# Altium schematic sheet Mainboard.SchDoc
size A4
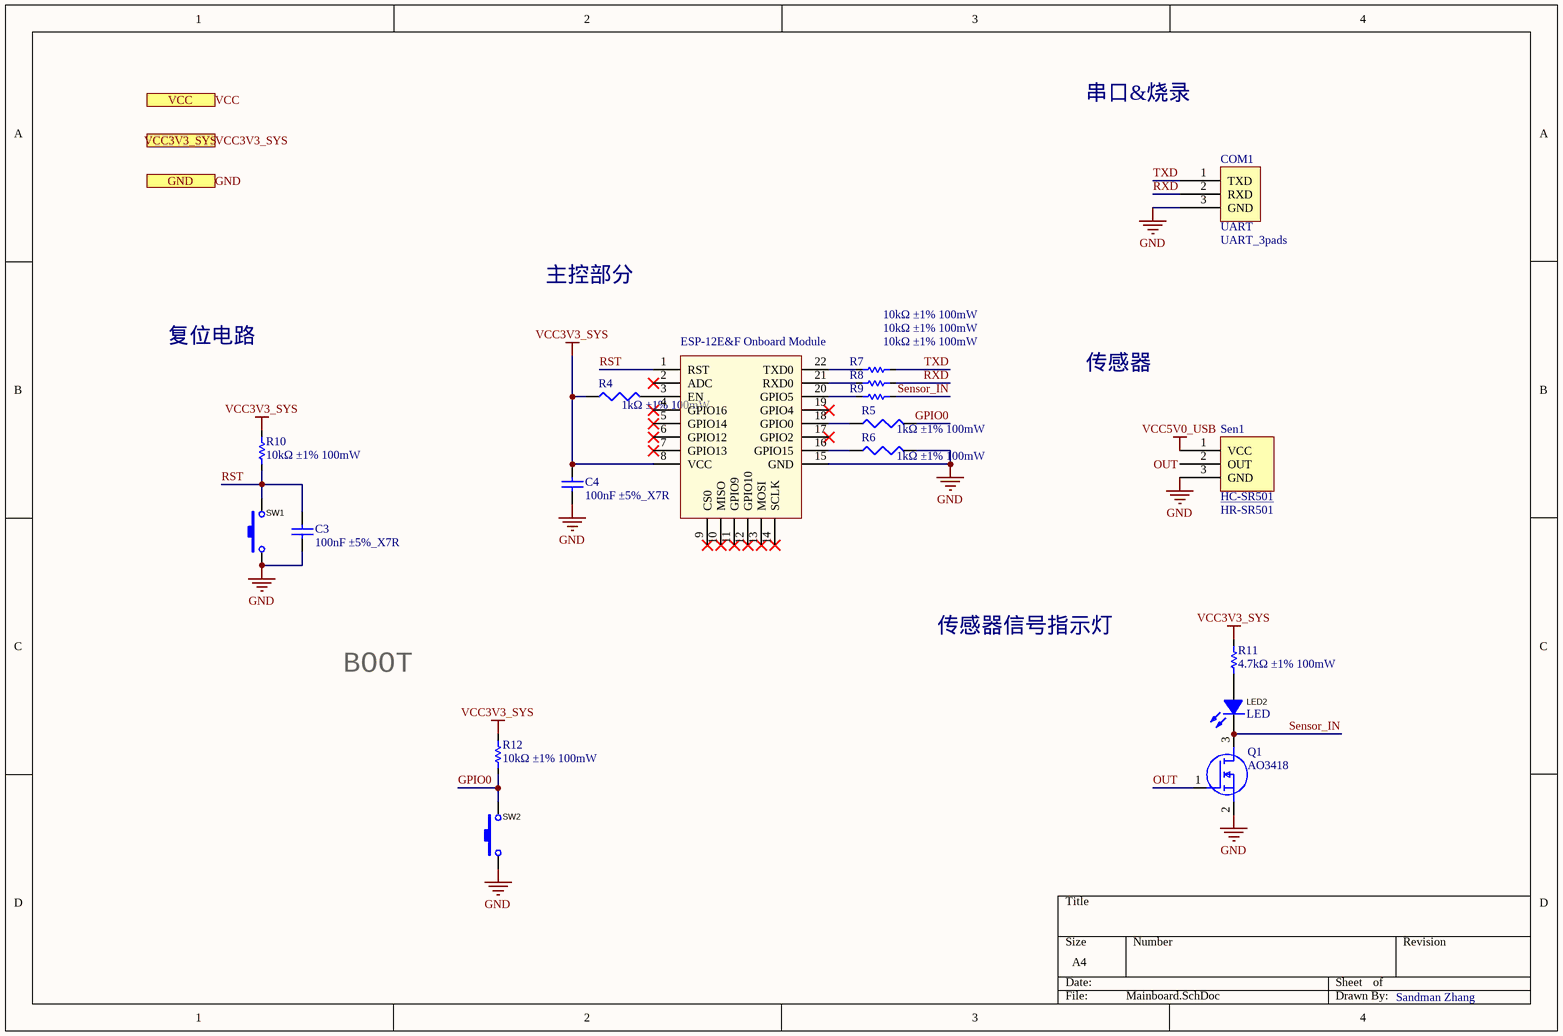
[diagram p0: Mainboard.SchDoc]

## Parts
C3  100nF ±5%_X7R  [C0603]
C4  100nF ±5%_X7R  [C0603]
COM1  UART_3pads  [3pads]
LED2  LED  [LED0603-RD]
Q1  AO3418  [SOT95P280X125-3N]
R4  value 1kΩ ±1% 100mW  [r0402]  (hidden comment: Res3)
R5  value 1kΩ ±1% 100mW  [r0402]  (hidden comment: Res3)
R6  value 1kΩ ±1% 100mW  [r0402]  (hidden comment: Res3)
R7  10kΩ ±1% 100mW  [R0402]
R8  10kΩ ±1% 100mW  [R0402]
R9  10kΩ ±1% 100mW  [R0402]
R10  10kΩ ±1% 100mW  [R0402]
R11  4.7kΩ ±1% 100mW  [R0603]
R12  10kΩ ±1% 100mW  [R0402]
Sen1  HR-SR501  [HR-SR501]
SW1  TS-1185-B-A-B-A  [SW-SMD_L4.0-W3.0-LS5.0]  (value not drawn)
SW2  TS-1185-B-A-B-A  [SW-SMD_L4.0-W3.0-LS5.0]  (value not drawn)
U2  ESP-12E&F Onboard Module  [ESP-12E&F Module]

## Ports
GND, VCC, VCC3V3_SYS

## Nets
GND: C3.1 C4.1 COM1.3(GND) Q1.2(S) R6.2 Sen1.3(GND) SW1.1 SW2.1 U2.15(GND) ; port GND
VCC3V3_SYS: C4.2 R4.1 R10.2 R11.1 R12.2 U2.8(VCC) ; port VCC3V3_SYS
VCC5V0_USB: Sen1.1(VCC)
GPIO0: R5.2 R12.1 SW2.2
OUT: Q1.1(G) Sen1.2(OUT)
RST: C3.2 R10.1 SW1.2 U2.1(RST)
RXD: COM1.2(RXD) R8.1
Sensor_IN: LED2.2(K) Q1.3(D) R9.1
TXD: COM1.1(TXD) R7.1
VCC: port VCC
NetLED2_1: LED2.1(A) R11.2
NetR4_2: R4.2 U2.3(EN)
NetR5_1: R5.1 U2.18(GPIO0)
NetR6_1: R6.1 U2.16(GPIO15)
NetR7_2: R7.2 U2.22(TXD0)
NetR8_2: R8.2 U2.21(RXD0)
NetR9_2: R9.2 U2.20(GPIO5)

Not connected (* = marked no-connect by the designer): U2 2(ADC)* 4(GPIO16)* 5(GPIO14)* 6(GPIO12)* 7(GPIO13)* 9(CS0)* 10(MISO)* 11(GPIO9)* 12(GPIO10)* 13(MOSI)* 14(SCLK)* 17(GPIO2)* 19(GPIO4)*

## Notes on the sheet
- 串口&烧录
- 主控部分
- 复位电路
- 传感器
- 传感器信号指示灯
- BOOT
- Sandman Zhang
- (in symbol HR-SR501) HC-SR501
- (in symbol UART_3pads) UART

## Library data of the parts
C3 C4 = Cap: Capacitor; Published: 8-Jun-2000; LatestRevisionDate: 17-Jul-2002; LatestRevisionNote: Re-released for DXP Platform.; PackageReference: RAD-0.3; Publisher: Altium Limited; PackageDescription: Radial Cap, Thru-Hole; 2 Leads; 0.3 in Pin Spacing
LED2 = LED: 发光颜色:; Manufacturer: EVERLIGHT(亿光); Name: 17-21SURC/S530-A2/TR8; Add into BOM: yes; Emitted Color: 红灯; Symbol: 17-21SURC/S530-A2/TR8; Device: 17-21SURC/S530-A2/TR8; LCSC Part Name: 红灯; Supplier Part: C131244; Manufacturer Part: 17-21SURC/S530-A2/TR8; Supplier Footprint: 0805; JLCPCB Part Class: Extended Part; Datasheet: https://atta.szlcsc.com/upload/public/pdf/source/20170918/C131244_1505726880590976254.pdf; Supplier: LCSC; Convert to PCB: yes
Q1 = AO3418: MOSFET (N-Channel); Manufacturer_Name: Alpha & Omega Semiconductors; Datasheet Link: http://www.aosmd.com/res/data_sheets/AO3418.pdf; Height: 1.25mm; Manufacturer_Part_Number: AO3418; Arrow Part Number: AO3418; Arrow Price/Stock: https://www.arrow.com/en/products/ao3418/alpha-and-omega-semiconductor
R4-R6 = Res3: Resistor; Published: 8-Jun-2000; LatestRevisionDate: 29-May-2009; LatestRevisionNote: IPC-7351 Footprint Added.; PackageReference: J1-0603; Publisher: Altium Limited; PackageDescription: Chip Resistor
R7-R12 = Res: Resistor; Published: 8-Jun-2000; LatestRevisionDate: 17-Jul-2002; LatestRevisionNote: Re-released for DXP Platform.; PackageReference: AXIAL-0.3; Publisher: Altium Limited; PackageDescription: Axial Device, Thru-Hole; 2 Leads; 0.3 in Pin Spacing
Sen1 = HR-SR501: 人体红外感应模块
SW1 SW2 = Button: 触点电流：50mA 额定电压(DC)：12V 电路结构：单刀单掷 安装方式：立贴 带灯：无 作用力：160gf 机械寿命：10万次 带支架：否 轻触开关3x4x2贴片2脚小龟 160gf; Manufacturer: XKB Connectivity(中国星坤); Add into BOM: yes; Contact Current: 50mA; Voltage Rating (DC): 12V; Circuit: 单刀单掷; Actuator Style: 圆形按钮; Actuator/Cap Color: 黑色; With Lamp: 无; Mechanical Life: 10万次; Switch Length: 4mm; Switch Width: 3mm; Switch Height: 2mm; Strike Gundam: 否; Name: TS-1185-B-A-B-A; Symbol: TS-1185-B-A-B-A; Device: TS-1185-B-A-B-A; LCSC Part Name: 4*3*2mm 立贴 轻触开关; Supplier Part: C561517; Manufacturer Part: TS-1185-B-A-B-A; Supplier Footprint: SMD; JLCPCB Part Class: Extended Part; Datasheet: https://atta.szlcsc.com/upload/public/pdf/source/20211011/C2F26DC0AE1820400F54DBF49644F5A1.pdf; Supplier: LCSC; Convert to PCB: yes; Insulation Resistance: -; Mounting Style: 立贴; Operating Force: 160gf; Operating Temperature: -30℃~+85℃